# EAGLE design 1-voice(2_2) (EAGLE 9.3.2)

## Sheet 1 of 2
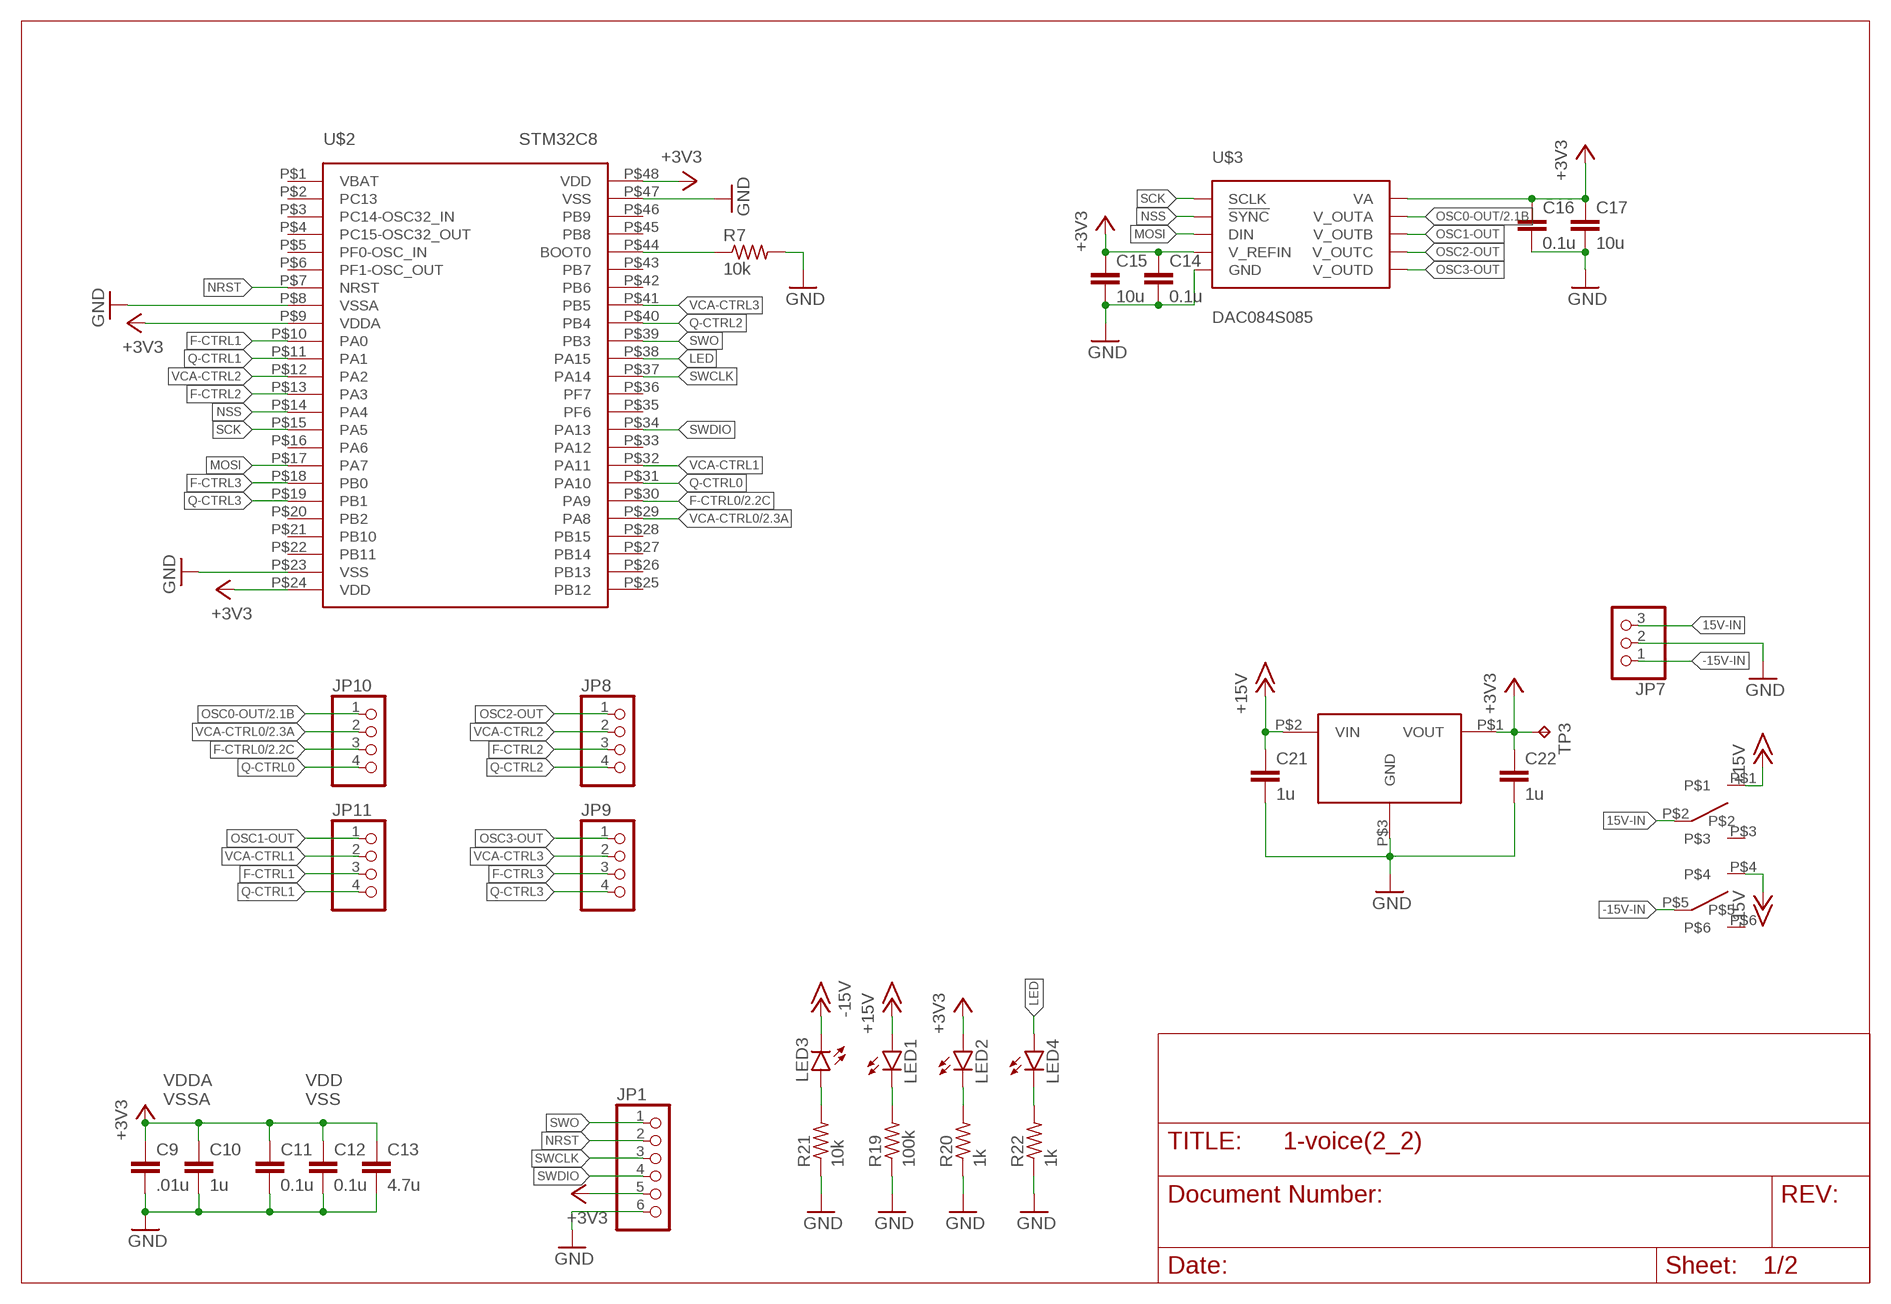
[diagram p0: schematic, sheet 1]

### Parts
C9  .01u  C-EUC0603  [C0603]
C10  1u  C-EUC0603  [C0603]
C11  0.1u  C-EUC0603  [C0603]
C12  0.1u  C-EUC0603  [C0603]
C13  4.7u  C-EUC0603  [C0603]
C14  0.1u  C-EUC0603  [C0603]
C15  10u  C-EUC0603  [C0603]
C16  0.1u  C-EUC0603  [C0603]
C17  10u  C-EUC0603  [C0603]
C21  1u  C-EUC0603  [C0603]
C22  1u  C-EUC0603  [C0603]
JP1  PINHD-1X6  [1X06]
JP7  PINHD-1X3  [1X03]
JP8  PINHD-1X4  [1X04]
JP9  PINHD-1X4  [1X04]
JP10  PINHD-1X4  [1X04]
JP11  PINHD-1X4  [1X04]
LED1  LEDSMT1206  [1206]
LED2  LEDSMT1206  [1206]
LED3  LEDSMT1206  [1206]
LED4  LEDSMT1206  [1206]
R7  10k  R-US_R0603  [R0603]
R19  100k  R-US_R0603  [R0603]
R20  1k  R-US_R0603  [R0603]
R21  10k  R-US_R0603  [R0603]
R22  1k  R-US_R0603  [R0603]
TP3  TPPAD1-13  [P1-13]
U$2  STM32C8  [LQFP48]
U$3  DAC084S085  [VSSOP10]
U$4  TLV760  [SOT23-3]
U$6  SWITCH-DPDT  [DPDT]

### Nets
15V-IN: JP7.3 U$6.P$2
+3V3: C9.1 C10.1 C11.1 C12.1 C13.1 C14.1 C15.1 C16.1 C17.1 C22.1 JP1.5 LED2.A TP3.TP U$2.P$9(VDDA) U$2.P$24(VDD) U$2.P$48(VDD) U$3.P$1(VA) U$3.P$7(V_REFIN) U$4.P$1(VOUT) ; also sheet 2
+15V: C21.1 LED1.A U$4.P$2(VIN) U$6.P$1 ; also sheet 2
-15V: LED3.C U$6.P$4 ; also sheet 2
-15V-IN: JP7.1 U$6.P$5
F-CTRL0: JP10.3 U$2.P$30(PA9) ; also sheet 2
F-CTRL1: JP11.3 U$2.P$10(PA0)
F-CTRL2: JP8.3 U$2.P$13(PA3)
F-CTRL3: JP9.3 U$2.P$18(PB0)
GND: C9.2 C10.2 C11.2 C12.2 C13.2 C14.2 C15.2 C16.2 C17.2 C21.2 C22.2 JP1.6 JP7.2 R7.2 R19.1 R20.1 R21.1 R22.1 U$2.P$8(VSSA) U$2.P$23(VSS) U$2.P$47(VSS) U$3.P$6(GND) U$4.P$3(GND) ; also sheet 2
LED: LED4.A U$2.P$38(PA15)
MOSI: U$2.P$17(PA7) U$3.P$8(DIN)
N$8: R7.1 U$2.P$44(BOOT0)
N$17: LED1.C R19.2
N$18: LED2.C R20.2
N$21: LED3.A R21.2
N$22: LED4.C R22.2
NRST: JP1.2 U$2.P$7(NRST)
NSS: U$2.P$14(PA4) U$3.P$9(!SYNC)
OSC0-OUT: JP10.1 U$3.P$2(V_OUTA) ; also sheet 2
OSC1-OUT: JP11.1 U$3.P$3(V_OUTB)
OSC2-OUT: JP8.1 U$3.P$4(V_OUTC)
OSC3-OUT: JP9.1 U$3.P$5(V_OUTD)
Q-CTRL0: JP10.4 U$2.P$31(PA10)
Q-CTRL1: JP11.4 U$2.P$11(PA1)
Q-CTRL2: JP8.4 U$2.P$40(PB4)
Q-CTRL3: JP9.4 U$2.P$19(PB1)
SCK: U$2.P$15(PA5) U$3.P$10(SCLK)
SWCLK: JP1.3 U$2.P$37(PA14)
SWDIO: JP1.4 U$2.P$34(PA13)
SWO: JP1.1 U$2.P$39(PB3)
VCA-CTRL0: JP10.2 U$2.P$29(PA8) ; also sheet 2
VCA-CTRL1: JP11.2 U$2.P$32(PA11)
VCA-CTRL2: JP8.2 U$2.P$12(PA2)
VCA-CTRL3: JP9.2 U$2.P$41(PB5)
Unconnected: U$2.P$1(VBAT) U$2.P$2(PC13) U$2.P$3(PC14-OSC32_IN) U$2.P$4(PC15-OSC32_OUT) U$2.P$5(PF0-OSC_IN) U$2.P$6(PF1-OSC_OUT) U$2.P$16(PA6) U$2.P$20(PB2) U$2.P$21(PB10) U$2.P$22(PB11) U$2.P$25(PB12) U$2.P$26(PB13) U$2.P$27(PB14) U$2.P$28(PB15) U$2.P$33(PA12) U$2.P$35(PF6) U$2.P$36(PF7) U$2.P$42(PB6) U$2.P$43(PB7) U$2.P$45(PB8) U$2.P$46(PB9) U$6.P$3 U$6.P$6

### Notes on the sheet
- VDDA
  VSSA
- VDD
  VSS

## Sheet 2 of 2
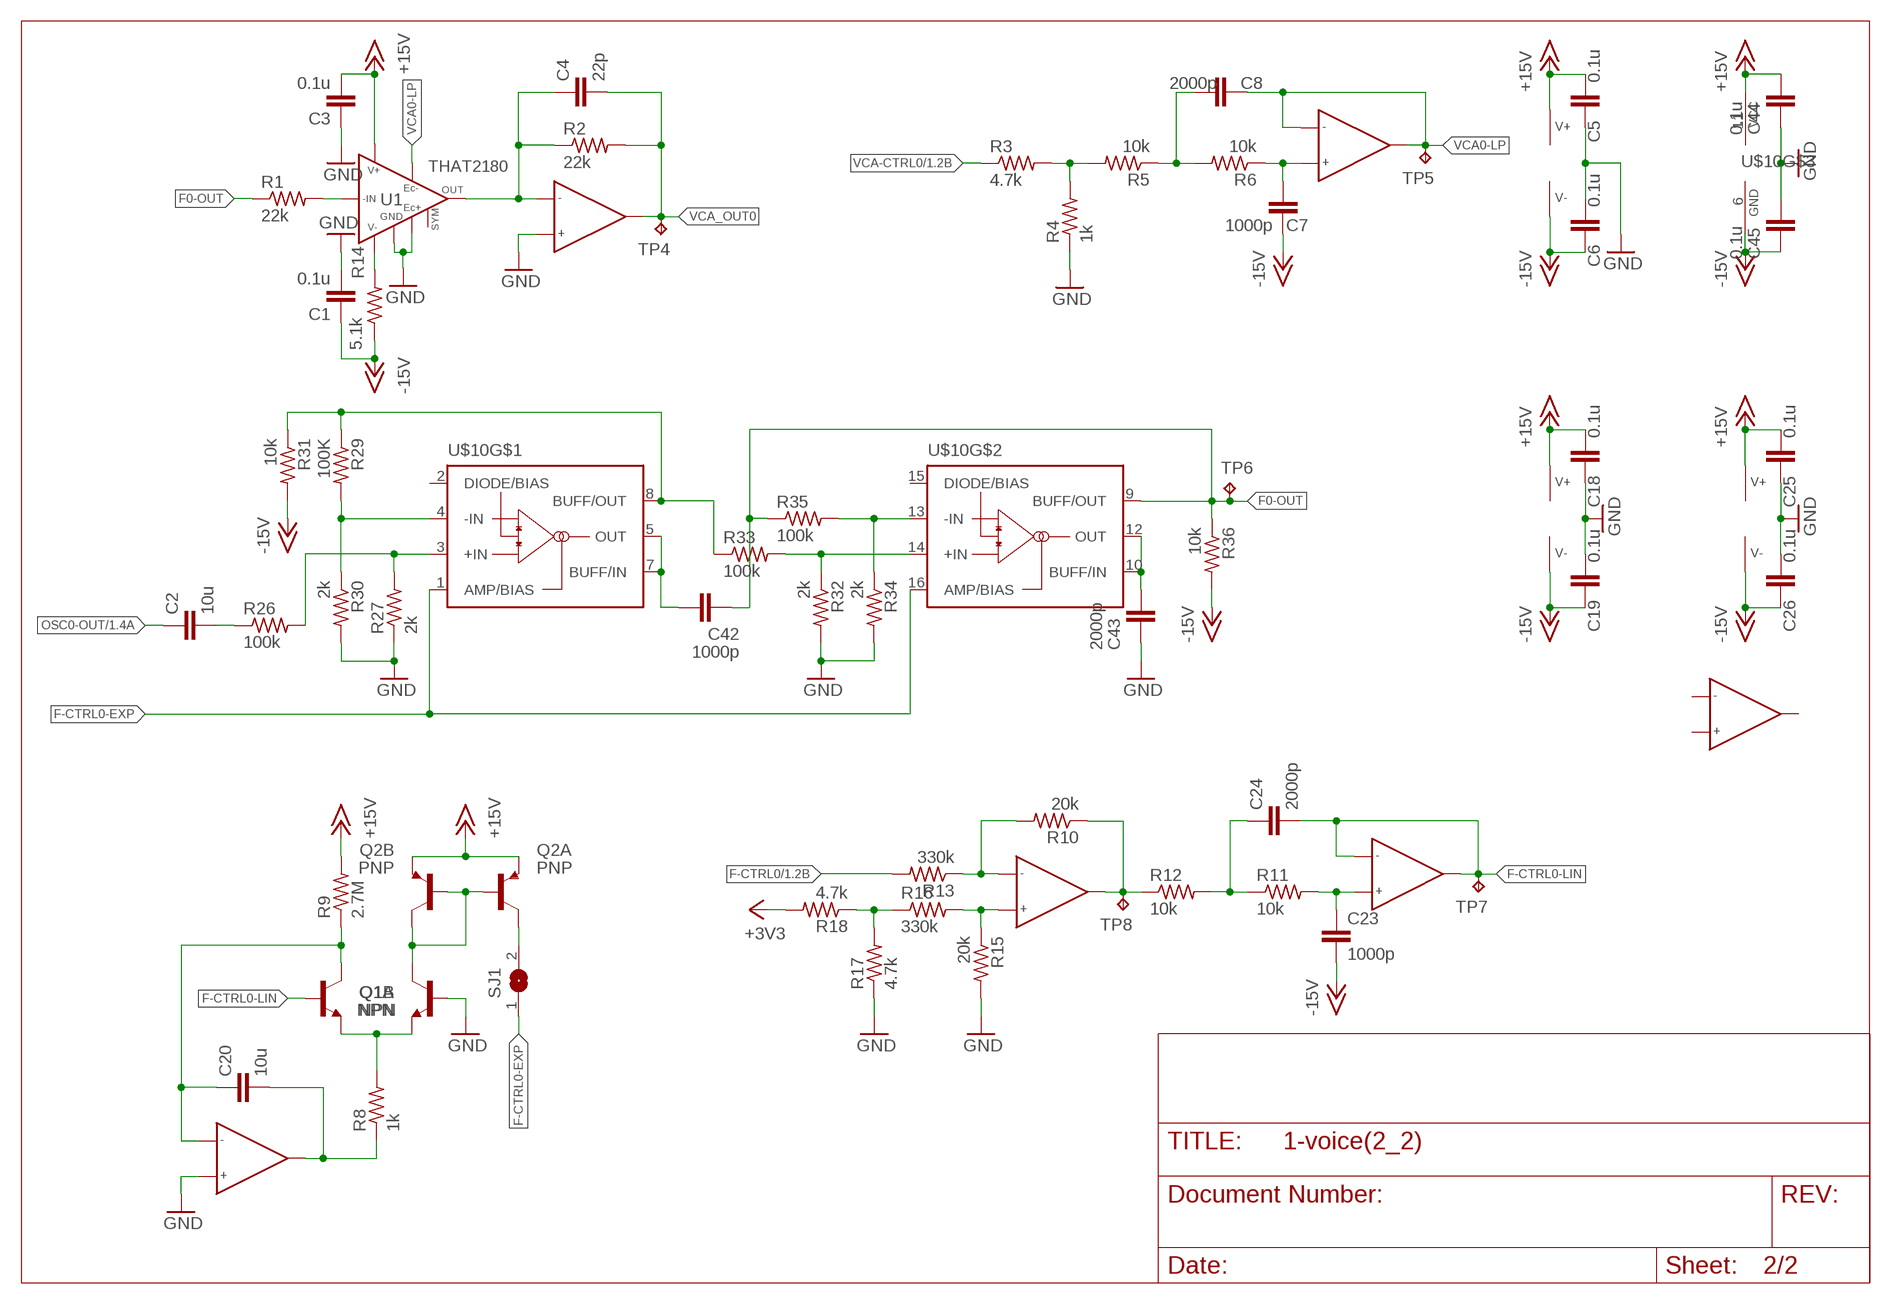
[diagram p1: schematic, sheet 2]

### Parts
C1  0.1u  C-EUC0603  [C0603]
C2  10u  C-EUC0603  [C0603]
C3  0.1u  C-EUC0603  [C0603]
C4  22p  C-EUC0603  [C0603]
C5  0.1u  C-EUC0603  [C0603]
C6  0.1u  C-EUC0603  [C0603]
C7  1000p  C-EUC0603  [C0603]
C8  2000p  C-EUC0603  [C0603]
C18  0.1u  C-EUC0603  [C0603]
C19  0.1u  C-EUC0603  [C0603]
C20  10u  C-EUC0603  [C0603]
C23  1000p  C-EUC0603  [C0603]
C24  2000p  C-EUC0603  [C0603]
C25  0.1u  C-EUC0603  [C0603]
C26  0.1u  C-EUC0603  [C0603]
C42  1000p  C-EUC0603  [C0603]
C43  2000p  C-EUC0603  [C0603]
C44  0.1u  C-EUC0603  [C0603]
C45  0.1u  C-EUC0603  [C0603]
Q1  NPN  TRANS-BJT_NPN-DUAL-BC847BS-JBLMASK  [SOT-363-JBLMASK]
Q2  PNP  TRANS-BJT_PNP-DUAL-BC857-JBLMASK  [SOT-363-JBLMASK]
R1  22k  R-US_R0603  [R0603]
R2  22k  R-US_R0603  [R0603]
R3  4.7k  R-US_R0603  [R0603]
R4  1k  R-US_R0603  [R0603]
R5  10k  R-US_R0603  [R0603]
R6  10k  R-US_R0603  [R0603]
R8  1k  R-US_R0603  [R0603]
R9  2.7M  R-US_R0603  [R0603]
R10  20k  R-US_R0603  [R0603]
R11  10k  R-US_R0603  [R0603]
R12  10k  R-US_R0603  [R0603]
R13  330k  R-US_R0603  [R0603]
R14  5.1k  R-US_R0603  [R0603]
R15  20k  R-US_R0603  [R0603]
R16  330k  R-US_R0603  [R0603]
R17  4.7k  R-US_R0603  [R0603]
R18  4.7k  R-US_R0603  [R0603]
R26  100k  R-US_R0603  [R0603]
R27  2k  R-US_R0603  [R0603]
R29  100K  R-US_R0603  [R0603]
R30  2k  R-US_R0603  [R0603]
R31  10k  R-US_R0603  [R0603]
R32  2k  R-US_R0603  [R0603]
R33  100k  R-US_R0603  [R0603]
R34  2k  R-US_R0603  [R0603]
R35  100k  R-US_R0603  [R0603]
R36  10k  R-US_R0603  [R0603]
SJ1  SJ  [SJ]
TP4  TPPAD1-13  [P1-13]
TP5  TPPAD1-13  [P1-13]
TP6  TPPAD1-13  [P1-13]
TP7  TPPAD1-13  [P1-13]
TP8  TPPAD1-13  [P1-13]
U1  THAT2180  [SIP8]
U$1  TL072  [SOIC8]
U$5  TL072  [SOIC8]
U$10  XX-13700DMP16  [DMP16]
U$11  TL072  [SOIC8]

### Nets
+3V3: R18.2 ; also sheet 1
+15V: C3.2 C5.2 C18.2 C25.2 C44.1 Q2.1(A:E) Q2.4(B:E) R9.2 U1.$P7(V+) U$1.P$8(V+) U$5.P$8(V+) U$10.11(VCC) U$11.P$8(V+) ; also sheet 1
-15V: C1.1 C6.1 C7.1 C19.1 C23.2 C26.1 C45.2 R14.1 R31.2 R36.2 U$1.P$4(V-) U$5.P$4(V-) U$10.6(GND) U$11.P$4(V-) ; also sheet 1
F0-OUT: C42.2 R1.1 R35.1 R36.1 TP6.TP U$10.9(BUFF/OUT)
F-CTRL0: R13.2 ; also sheet 1
F-CTRL0-EXP: SJ1.1 U$10.1(AMP/BIAS) U$10.16(AMP/BIAS)
F-CTRL0-LIN: C24.2 Q1.2(A:B) TP7.TP U$11.P$6(IN-) U$11.P$7(OUT)
FILT_IN: C2.2 R26.1
GND: C1.2 C3.1 C5.1 C6.2 C18.1 C19.2 C25.1 C26.2 C43.2 C44.2 C45.1 Q1.5(B:B) R4.1 R15.2 R17.1 R27.1 R30.2 R32.2 R34.2 U1.$P2(EC+) U1.$P6(GND) U$1.P$3(IN+) U$11.P$3(IN+) ; also sheet 1
N$1: R10.2 R13.1 U$5.P$6(IN-)
N$2: R1.2 U1.$P1(-IN)
N$3: C4.1 R2.1 U1.$P8(OUT) U$1.P$2(IN-)
N$4: R3.2 R4.2 R5.2
N$5: C8.2 R5.1 R6.2
N$6: C7.2 R6.1 U$1.P$5(IN+)
N$7: Q2.6(A:C) SJ1.2
N$9: Q1.1(A:E) Q1.4(B:E) R8.2
N$10: C20.2 R8.1 U$11.P$1(OUT)
N$11: C20.1 Q1.6(A:C) R9.1 U$11.P$2(IN-)
N$12: C23.1 R11.2 U$11.P$5(IN+)
N$13: Q1.3(B:C) Q2.2(A:B) Q2.3(B:C) Q2.5(B:B)
N$14: C24.1 R11.1 R12.2
N$15: R10.1 R12.1 TP8.TP U$5.P$7(OUT)
N$16: R14.2 U1.$P5(V-)
N$19: R16.1 R17.2 R18.1
N$20: R15.1 R16.2 U$5.P$5(IN+)
N$27: R26.2 R27.2 U$10.3(+IN)
N$31: R29.2 R30.1 U$10.4(-IN)
N$32: C42.1 U$10.5(OUT) U$10.7(BUFF/IN)
N$33: R29.1 R31.1 R33.1 U$10.8(BUFF/OUT)
N$34: C43.1 U$10.10(BUFF/IN) U$10.12(OUT)
N$35: R32.1 R33.2 U$10.14(+IN)
N$36: R34.1 R35.2 U$10.13(-IN)
OSC0-OUT: C2.1 ; also sheet 1
VCA0-LP: C8.1 TP5.TP U1.$P3(EC-) U$1.P$6(IN-) U$1.P$7(OUT)
VCA-CTRL0: R3.1 ; also sheet 1
VCA_OUT0: C4.2 R2.2 TP4.TP U$1.P$1(OUT)
Unconnected: U1.$P4(SYM) U$5.P$1(OUT) U$5.P$2(IN-) U$5.P$3(IN+) U$10.2(DIODE/BIAS) U$10.15(DIODE/BIAS)

## Library data of the parts
C1-C26 C42-C45 = rcl:C-EU: CAPACITOR, European symbol; SPICEPREFIX: C
JP1 = pinhead:PINHD-1X6: PIN HEADER
JP7 = pinhead:PINHD-1X3: PIN HEADER
JP8-JP11 = pinhead:PINHD-1X4: PIN HEADER
LED1-LED4 = led:LED: LED OSRAM: - CHIPLED LG R971, LG N971, LY N971, LG Q971, LY Q971, LO R971, LY R971 LH N974, LH R974 LS Q976, LO Q976, LY Q976 LO Q996 - Hyper CHIPLED LW Q18S LB Q993, LB Q99A, LB R99A - SideLED LS A670, LO A670, LY A670, LG A670, LP A670 LB A673, LV A673, LT A673, LW A673 LH A674 LY A675 LS A676, LA A676, LO A676, LY A676, LW A676 LS A679, LY A679, LG A679 - Hyper Micro SIDELED® LS Y876, LA Y876, LO Y876, LY Y876 LT Y87S - SmartLED LW L88C, LW L88S LB L89C, LB L89S, LG L890 LS L89K, LO L89K, LY L89K LS L896, LA L896, LO L896, LY L896 - TOPLED LS T670, LO T670, LY T670, LG T670, LP T670 LSG T670, LSP T670, LSY T670, LOP T670, LYG T670 LG T671, LOG T671, LSG T671 LB T673, LV T673, LT T673, LW T673 LH T674 LS T676, LA T676, LO T676, LY T676, LB T676, LH T676, LSB T676, LW T676 LB T67C, LV T67C, LT T67C, LS T67K, LO T67K, LY T67K, LW E67C LS E67B, LA E67B, LO E67B, LY E67B, LB E67C, LV E67C, LT E67C LW T67C LS T679, LY T679, LG T679 LS T770, LO T770, LY T770, LG T770, LP T770 LB T773, LV T773, LT T773, LW T773 LH T774 LS E675, LA E675, LY E675, LS T675 LS T776, LA T776, LO T776, LY T776, LB T776 LHGB T686 LT T68C, LB T68C - Hyper Mini TOPLED® LB M676 - Mini TOPLED Santana® LG M470 LS M47K, LO M47K, LY M47K Source: http://www.osram.convergy.de LUXEON: - LUMILED® LXK2-PW12-R00, LXK2-PW12-S00, LXK2-PW14-U00, LXK2-PW14-V00 LXK2-PM12-R00, LXK2-PM12-S00, LXK2-PM14-U00 LXK2-PE12-Q00, LXK2-PE12-R00, LXK2-PE12-S00, LXK2-PE14-T00, LXK2-PE14-U00 LXK2-PB12-K00, LXK2-PB12-L00, LXK2-PB12-M00, LXK2-PB14-N00, LXK2-PB14-P00, LXK2-PB14-Q00 LXK2-PR12-L00, LXK2-PR12-M00, LXK2-PR14-Q00, LXK2-PR14-R00 LXK2-PD12-Q00, LXK2-PD12-R00, LXK2-PD12-S00 LXK2-PH12-R00, LXK2-PH12-S00 LXK2-PL12-P00, LXK2-PL12-Q00, LXK2-PL12-R00 Source: www.luxeon.com KINGBRIGHT: KA-3528ASYC Source: www.kingbright.com
Q1 = LITTLEBITS:TRANS-BJT_NPN-DUAL
Q2 = LITTLEBITS:TRANS-BJT_PNP-DUAL
R1-R22 R26 R27 R29-R36 = rcl:R-US_: RESISTOR, American symbol; SPICEPREFIX: R
SJ1 = jumper:SJ: SMD solder JUMPER
TP3-TP8 = testpad:TP: Test pad
U1 = synth:THAT2180
U$1 U$5 U$11 = synth:TL072
U$2 = synth:STM32C8
U$3 = synth:DAC084S085
U$4 = synth:TLV760
U$6 = synth:SWITCH-DPDT
U$10 = LITTLEBITS:XX-13700

## Board
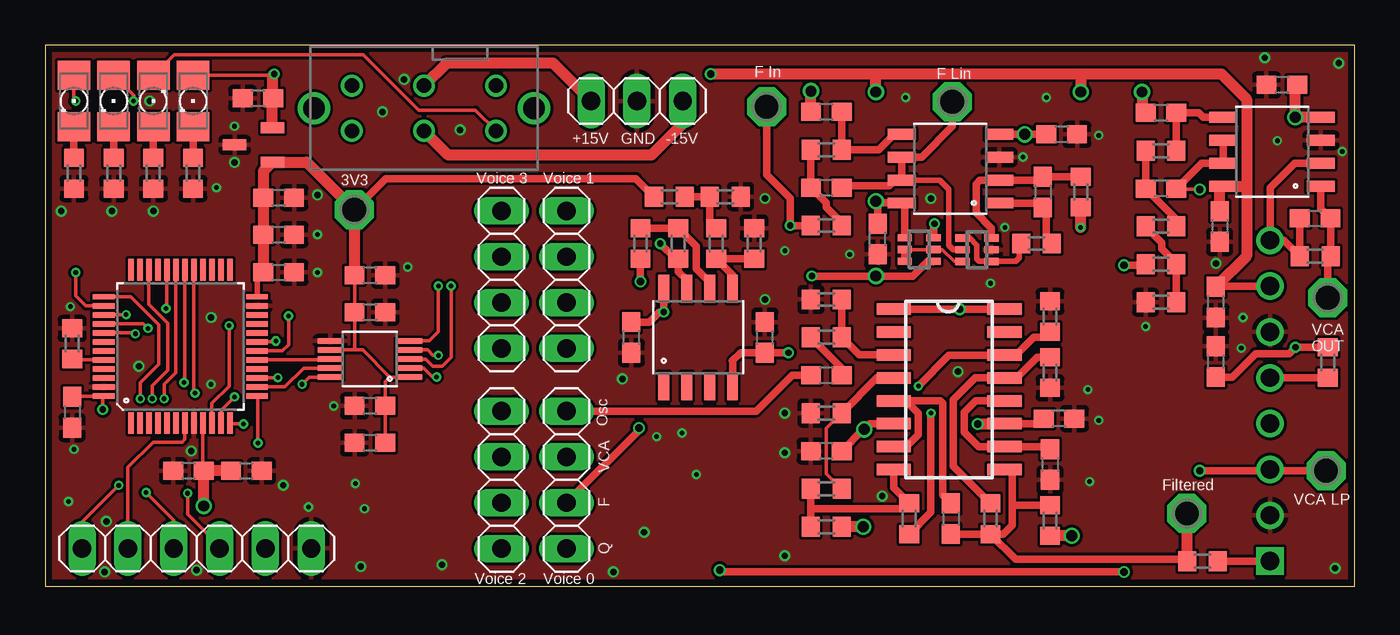
[diagram p2: board, top side]
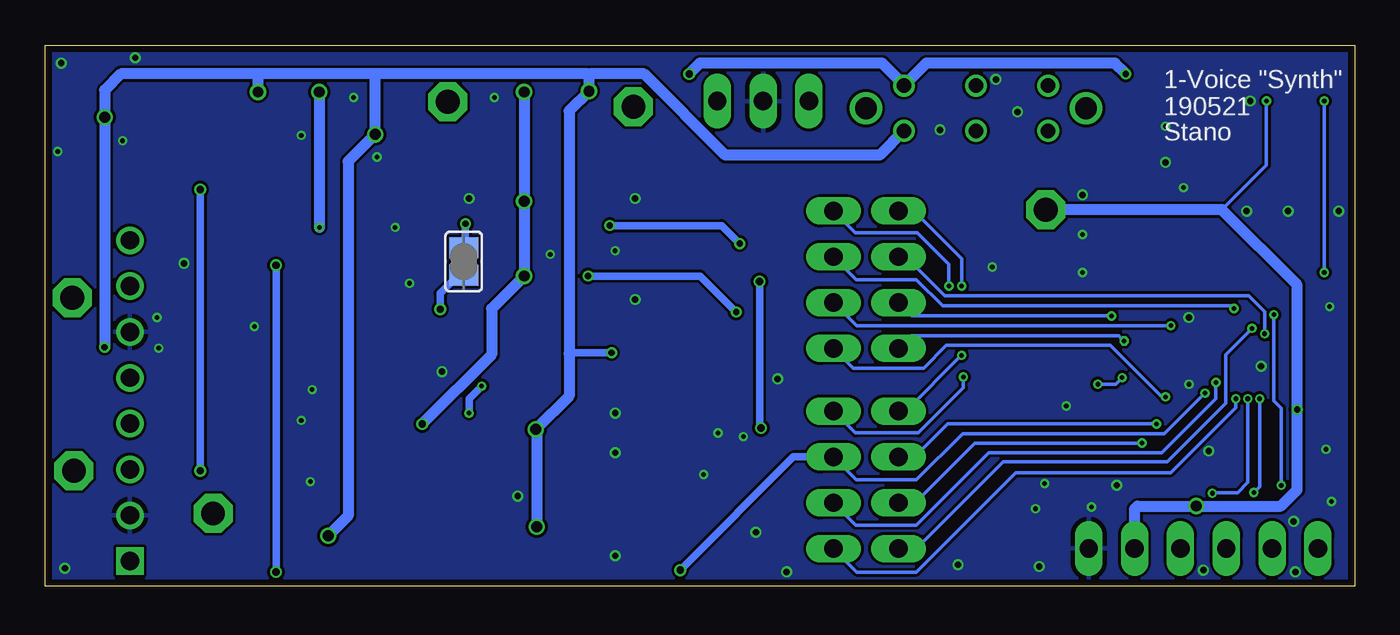
[diagram p3: board, bottom side, seen from below]

Size 72.6 x 30 mm. Coordinates in mm from the lower left corner, seen from the top.
Outline: 72.6,30 0,30 0,0 72.6,0 72.6,30
Copper layers (1*16): Top 0.035559375mm / dielectric 1.6mm / Bottom 0.035559375mm
Design rules "oshpark-2layer": minimum track width 6mil, minimum drill 10mil, track to track 6mil, track to pad 6mil, pad to pad 6mil, via to via 6mil, smd to smd 6mil, copper to edge 15mil, drill to drill 6mil, minimum pad ring 5mil, minimum via ring 5mil, stop-mask expansion 2.5mil, vias tented up to drill 0mil, thermal gap 10mil

### Footprints (pad centres in the part's own frame; a part is rotated, then mirrored left to right if it is on the bottom)
C0603 = smd 1.1 x 1: 1 -0.85,0; 2 0.85,0
1X06 = drill 1.016 long: 1 -6.35,0; 2 -3.81,0; 3 -1.27,0; 4 1.27,0; 5 3.81,0; 6 6.35,0
1X03 = drill 1.016 long: 1 -2.54,0; 2 0,0; 3 2.54,0
1X04 = drill 1.016 long: 1 -3.81,0; 2 -1.27,0; 3 1.27,0; 4 3.81,0
1206 = smd 1.6 x 1.803: A -1.422,0; C 1.422,0
SOT-363-JBLMASK = smd 0.4 x 0.8: 1 -0.65,-0.8; 2 0,-0.8; 3 0.65,-0.8; 4 0.65,0.8; 5 0,0.8; 6 -0.65,0.8
R0603 = smd 1 x 1.1: 1 -0.85,0; 2 0.85,0
SJ = smd 1.168 x 1.6: 1 -0.762,0; 2 0.762,0
P1-13 = drill 1.321 pad 2.159 octagon: TP 0,0
SIP8 = drill 1.016 square: $P1 0,0 | drill 1.016: $P2 2.54,0; $P3 5.08,0; $P4 7.62,0; $P5 10.16,0; $P6 12.7,0; $P7 15.24,0; $P8 17.78,0
SOIC8 = smd 0.6 x 1.55: P$1 -1.905,-2.7; P$2 -0.635,-2.7; P$3 0.635,-2.7; P$4 1.905,-2.7; P$5 1.905,2.7; P$6 0.635,2.7; P$7 -0.635,2.7; P$8 -1.905,2.7
LQFP48 = smd 0.3 x 1.2: P$1 -2.75,-4.25; P$2 -2.25,-4.25; P$3 -1.75,-4.25; P$4 -1.25,-4.25; P$5 -0.75,-4.25; P$6 -0.25,-4.25; P$7 0.25,-4.25; P$8 0.75,-4.25; P$9 1.25,-4.25; P$10 1.75,-4.25; P$11 2.25,-4.25; P$12 2.75,-4.25; P$25 2.75,4.25; P$26 2.25,4.25; P$27 1.75,4.25; P$28 1.25,4.25; P$29 0.75,4.25; P$30 0.25,4.25; P$31 -0.25,4.25; P$32 -0.75,4.25; P$33 -1.25,4.25; P$34 -1.75,4.25; P$35 -2.25,4.25; P$36 -2.75,4.25 | smd 1.2 x 0.3: P$13 4.25,-2.75; P$14 4.25,-2.25; P$15 4.25,-1.75; P$16 4.25,-1.25; P$17 4.25,-0.75; P$18 4.25,-0.25; P$19 4.25,0.25; P$20 4.25,0.75; P$21 4.25,1.25; P$22 4.25,1.75; P$23 4.25,2.25; P$24 4.25,2.75; P$37 -4.25,2.75; P$38 -4.25,2.25; P$39 -4.25,1.75; P$40 -4.25,1.25; P$41 -4.25,0.75; P$42 -4.25,0.25; P$43 -4.25,-0.25; P$44 -4.25,-0.75; P$45 -4.25,-1.25; P$46 -4.25,-1.75; P$47 -4.25,-2.25; P$48 -4.25,-2.75
VSSOP10 = smd 1.45 x 0.3: P$1 -2.2,1; P$2 -2.2,0.5; P$3 -2.2,0; P$4 -2.2,-0.5; P$5 -2.2,-1; P$6 2.2,-1; P$7 2.2,-0.5; P$8 2.2,0; P$9 2.2,0.5; P$10 2.2,1
SOT23-3 = smd 0.6 x 1.3: P$1 -0.95,-1.05; P$2 0.95,-1.05; P$3 0,1.05
DPDT = drill 0.8: P$1 -4,-1.25; P$2 0,-1.25; P$3 4,-1.25; P$4 -4,1.25; P$5 0,1.25; P$6 4,1.25 | drill 1.2: P$7 -6.1,0; P$8 6.1,0
DMP16 = smd 1.91 x 0.64: 1 -6.47,9.145; 2 -6.47,7.875; 3 -6.47,6.605; 4 -6.47,5.335; 5 -6.47,4.065; 6 -6.47,2.795; 7 -6.47,1.525; 8 -6.47,0.255; 9 -0.33,0.255; 10 -0.33,1.525; 11 -0.33,2.795; 12 -0.33,4.065; 13 -0.33,5.335; 14 -0.33,6.605; 15 -0.33,7.875; 16 -0.33,9.145

### Placement (x,y rotation side)
C1  64.9,12.45 90 top
C2  43.3,11.7 0 top
C3  64.9,15.75 90 top
C4  70.4,20.4 0 top
C5  46.15,19.25 90 top
C6  68.55,27.8 180 top
C7  61.85,26.25 0 top
C8  61.85,22.05 180 top
C9  11.15,6.4 0 top
C10  7.95,6.4 180 top
C11  12.95,17.4 0 top
C12  1.5,9.65 270 top
C13  12.95,19.5 0 top
C14  18,15.2 0 top
C15  18,17.25 0 top
C16  18,10 180 top
C17  18,7.95 180 top
C18  56.2,9.3 180 top
C19  43.3,7.5 180 top
C20  55.3,21.85 270 top
C21  11.8,27.05 180 top
C22  12.95,21.55 0 top
C23  43.3,26.3 180 top
C24  43.3,22.1 0 top
C25  32.5,13.8 90 top
C26  39.9,13.8 90 top
C42  50.2,3.75 270 top
C43  55.7,6.75 270 top
C44  65.1,19.95 270 top
C45  56.35,25.05 180 top
JP1  8.4,2.1 0 top
JP7  32.8,26.9 180 top
JP8  25.3,5.9 270 top
JP9  25.3,17 270 top
JP10  28.9,5.9 270 top
JP11  28.9,17 270 top
LED1  8.2,26.9 270 top
LED2  3.8,26.9 270 top
LED3  6,26.9 90 top
LED4  1.6,26.9 270 top
Q1  51.65,18.66 270 top
Q2  48.45,18.67 270 top
R1  64.15,1.4 0 top
R2  70.4,18.3 0 top
R3  61.85,17.85 0 top
R4  61.85,15.75 0 top
R5  61.85,19.95 180 top
R6  61.85,24.15 180 top
R7  1.5,13.45 90 top
R8  54.95,19 180 top
R9  57.4,21.85 270 top
R10  35.1,19 90 top
R11  43.3,24.2 0 top
R12  43.3,20 0 top
R13  33,19 270 top
R14  71.1,12.4 270 top
R15  39.3,19 90 top
R16  37.2,19 270 top
R17  37.7,21.6 180 top
R18  34.6,21.6 180 top
R19  8.2,22.9 90 top
R20  3.8,22.9 90 top
R21  6,22.9 90 top
R22  1.6,22.9 90 top
R26  43.3,13.8 0 top
R27  43.3,15.9 0 top
R29  43.3,5.4 0 top
R30  43.3,9.6 180 top
R31  43.3,3.3 0 top
R32  55.7,14.95 90 top
R33  47.9,3.75 270 top
R34  55.7,11.85 270 top
R35  52.4,3.75 90 top
R36  55.7,3.65 270 top
SJ1  49.4,18 90 bottom
TP3  17.14,20.88 0 top
TP4  71.09,16 0 top
TP5  71,6.4 0 top
TP6  63.29,4.04 0 top
TP7  50.29,26.86 0 top
TP8  39.99,26.58 0 top
U1  67.9,1.4 90 top
U$1  68.01,24.09 90 top
U$2  7.5,13.3 0 top
U$3  18,12.6 180 top
U$4  11.55,24.47 90 top
U$5  36.2,13.8 0 top
U$6  21,26.5 180 top
U$10  53.51,6.22 0 top
U$11  50.18,23.15 90 top

### Tracks (layer width: path | path; a pad name or v marks a point on that pad's centre or on a via)
15V-IN
  Top 0.61: JP7.3 28.16,29 22.25,29 U$6.P$2
+3V3  (via drill 0.25, 0.35, 0.6)
  Top 0.203: U$3.P$7 17.2,13.1 | 17.2,13.1 17.6,13.1 19.1,11.6 | 19.1,11.6 U$3.P$1 | C11.1 11.75,17.05 | 17.2,13.1 17.15,13.15 C14.1 C15.1 | C17.1 C16.1 18.85,11.35 19.1,11.6 | U$2.P$9 8.75,6.45 C10.1 | LED2.A 4.9,27.22 v4.9,26.9 | v3.2,9.8 3.2,10.5 U$2.P$48 1.55,10.55 C12.1
  Top 0.305: 11.75,17.05 U$2.P$24
  Top 0.406: R18.2 32.75,22.6 18.88,22.6 TP3.TP
  Top 0.61: v8.8,4.45 C10.1 C9.1 | C11.1 C13.1 C22.1 12.1,23.02 U$4.P$1 14.5,23.52 TP3.TP C15.1
  Bottom 0.203: v4.9,26.9 4.9,23.35 7.37,20.88
  Bottom 0.61: JP1.5 12.21,4.29 12.05,4.45 v8.8,4.45 4.1,4.45 3.2,5.35 v3.2,9.8 3.2,16.71 7.37,20.88 TP3.TP
+15V  (via drill 0.25, 0.35, 0.4, 0.6)
  Top 0.203: 64.94,16.64 C3.2 | 47.65,21.07 U$11.P$8 | Q2.4 49.23,18 | 55.07,9.02 C18.2 | LED1.A 12.62,28.32 v12.7,28.4
  Top 0.406: U1.$P7 64.94,16.64 | Q2.1 47.65,21.07 | 49.23,18 48.9,18 48.1,17.2 v46.05,17.2 v42.5,17.2 | U$10.11 55.07,9.02 | U$11.P$8 46.15,21.25 | v46.05,21.35 46.15,21.25 | C5.2 46.15,21.25 | C25.2 33.5,14.65 34.05,15.21 v34.3,15.21 U$5.P$8
  Top 0.61: v36.9,28.4 46.05,28.4 | v51.7,9 51.72,9.02 U$10.11 | 57.4,28.4 v57.4,27.4 | v57.4,19.9 R9.2 | 66.6,22.2 66.6,18.3 C3.2 | C44.1 65.1,21.98 U$1.P$8 66.58,22.18 66.6,22.2 | v46.05,27.4 46.05,28.4 | 57.4,28.4 65.2,28.4 66.6,27 66.6,22.2 | 46.05,28.4 57.4,28.4 | v12.7,28.4 12.6,28.3 12.6,27.1 C21.1 12.6,27 U$4.P$2
  Bottom 0.406: v34.3,15.21 36.29,17.2 v42.5,17.2
  Bottom 0.61: v57.4,27.4 v57.4,19.9 | v46.05,27.4 v46.05,21.35 v46.05,17.2 47.85,15.4 47.85,12.85 v51.7,9 | v36.9,28.4 36.3,29 26.2,29 25,27.8 U$6.P$1 23.75,29 13.3,29 v12.7,28.4
-15V  (via drill 0.35, 0.6)
  Top 0.203: v54.3,25.05 | U$6.P$4 23.85,26.4 20.7,26.4 17.62,29.48 7.15,29.48 LED3.C
  Top 0.406: U$11.P$4 v54.3,25.05 | v54.3,25.05 C45.2 | U$5.P$4 38.11,12.49 38.1,12.5 38.55,12.95 C26.1 v41.2,12.95 | U$10.6 45.72,9.02 v45.4,8.7 45.35,8.7 C19.1 | R14.1 v69.3,13.25 68.95,12.9 67.1,12.9 65.8,11.6 C1.1
  Top 0.61: C23.2 v42.45,27.45 | v56.9,2.8 R36.2 | v60.8,27.4 60.8,26.45 C7.1 | U$1.P$4 v69.3,26 69.3,27.7 C6.1 | v45.35,3.3 R31.2
  Bottom 0.406: v41.2,12.95 43.5,12.95 43.55,12.9
  Bottom 0.61: 42.45,28.35 42.4,28.4 39.4,28.4 34.9,23.9 26.35,23.9 U$6.P$4 | 54.3,28.4 42.5,28.4 42.45,28.35 | 54.3,28.4 60.8,28.4 | 60.8,28.4 68.4,28.4 69.3,27.5 v69.3,26 v69.3,13.25 | 42.45,28.35 v42.45,27.45 43.55,26.35 43.55,12.9 43.55,10.55 v45.4,8.7 45.35,8.7 v45.35,3.3 | 54.3,28.4 v54.3,25.05 55.8,23.55 55.8,3.9 v56.9,2.8 | 60.8,28.4 v60.8,27.4
-15V-IN
  Top 0.61: JP7.1 35.34,25.64 33.6,23.9 22.35,23.9 U$6.P$5
F0-OUT
  Top 0.203: 53.6,6.2 53.7,6.3 53.52,6.47 U$10.9
  Top 0.406: R35.1 53.1,2.9 53.6,3.4 53.6,4.5 | 53.6,4.5 53.6,6.2 | C42.2 R35.1 | R36.1 53.6,4.5 | R1.1 63.2,1.5 53.8,1.5 R35.1
  Top 0.61: TP6.TP R1.1
F-CTRL0  (via drill 0.25, 0.4)
  Top 0.203: U$2.P$30 7.75,11.35 v7.7,11.3
  Top 0.406: R13.2 v33,16.9 | JP10.3 32.92,8.65 v32.92,8.78
  Bottom 0.203: v7.7,11.3 7.7,10.4 10.7,7.4 20.3,7.4 24.3,3.4 27.67,3.4 JP10.3
  Bottom 0.406: v32.92,8.78 33,8.86 v33,16.9
F-CTRL0-EXP  (via drill 0.4)
  Top 0.406: U$10.1 v50.7,15.37 U$10.16
  Bottom 0.406: SJ1.1 49.7,17.24 50.7,16.24 v50.7,15.37
F-CTRL0-LIN
  Top 0.203: 47.12,22.52 U$11.P$7
  Top 0.305: U$11.P$7 49.59,22.52 50.1,22 50.1,18.9 50.34,18.66 Q1.2
  Top 0.406: U$11.P$7 U$11.P$6 48.59,23.79 50.29,25.49 TP7.TP | C24.2 44.25,22.2 46.8,22.2 47.12,22.52
F-CTRL1  (via drill 0.25)
  Top 0.203: U$2.P$10 9.25,10.15 10.2,11.1 v10.2,14.45
  Bottom 0.203: JP11.3 27.62,14.45 v10.2,14.45
F-CTRL2  (via drill 0.25)
  Top 0.203: U$2.P$13 11.8,10.5 v11.8,7.94
  Bottom 0.203: v11.8,7.94 21.06,7.94 24.4,4.6 25.27,4.6 JP8.3
F-CTRL3  (via drill 0.25)
  Top 0.203: U$2.P$18 13.15,13.05 13.5,13.4 v13.5,14.98 v13.49,14.99
  Bottom 0.203: v13.49,14.99 v13.49,15 24.57,15 JP9.3
FILT_IN
  Top 0.406: C2.2 44.15,12.1 R26.1
GND  (via drill 0.25, 0.35)
  other vias: 53.2,19.9 35.3,8.5 33.9,8.3 1.3,4.7 14.6,4.4 17.7,4.3 17.2,5.7 9.2,11.2 15.1,19.5 15.1,17.4 20.1,17.7 9.5,22.1 10.5,25.5 47.7,27.1 54.2,23.8 68.3,24.7 71.9,24.1 58.4,25 61,14.4 66.4,14.9 66.3,13.2 57.9,5.8 58.4,9.2 57.8,10.9 36.1,6.2 41,18.6 44.6,18.4 52.4,16.8 16,10 1.4,15.5 1.6,7.6 55.5,27.1 0.9,20.8 3.7,20.8 6,20.8 10.5,23.5 5.2,12.2 9.2,14.9 8.1,7.5 13.2,5.6 17.5,1.1 22,1.2 15.1,21.7 18.7,26.3 39.9,21.5 39.9,15.9 33.2,3 31.5,0.8 41,1.7 41,7.4 41,9.6 32,11.5 67.6,29.3 71.7,29 64.9,17.9 71.5,1 3.4,3.6 3.3,0.8 8.4,0.9 19.9,28.1 23,25.3 46.4,5 50.6,11.9 49.1,21.5 5.8,26.9
  pour Top: 0,0 0,30 72.6,30 72.6,0
  pour Bottom: 0,0 0,30 72.6,30 72.6,0
LED  (via drill 0.25)
  Top 0.203: v1.7,26.9 1.6,27 LED4.A | v1.7,17.4 1.7,16.1 2.25,15.55 U$2.P$38
  Bottom 0.203: v1.7,26.9 v1.7,17.4
MOSI
  Top 0.203: U$3.P$8 15.75,12.55 U$2.P$17
N$1
  Top 0.406: U$5.P$6 36.84,16.86 36.1,17.6 36.1,18.85 R10.2 R13.1
N$2
  Top 0.406: U1.$P1 R1.2
N$3
  Top 0.406: C4.1 R2.1 68.67,19.18 U1.$P8 67.9,22.1 69.25,23.45 U$1.P$2
N$4
  Top 0.203: 62.7,17.9 R3.2
  Top 0.406: R5.2 61.9,19.05 61.9,18.7 62.7,17.9 | R3.2 R4.2
N$5
  Top 0.203: 62.7,20.35 R5.1
  Top 0.406: R6.2 C8.2 62.7,20.35
N$6
  Top 0.406: R6.1 C7.2 63.95,26.25 64.2,26 U$1.P$5
N$7  (via drill 0.35)
  Top 0.406: Q2.6 49.25,20.05 v49.3,20.1
  Bottom 0.406: v49.3,20.1 49.3,18.86 SJ1.2
N$8
  Top 0.203: U$2.P$44 1.55,12.55 R7.1
N$9
  Top 0.203: 54,18.9 R8.2
  Top 0.305: Q1.1 51.24,19.31 51.65,18.9 51.65,18.15 51.79,18.01 Q1.4 53.81,18.01 54,18.2 54,18.9
N$10
  Top 0.203: 55.05,21.25 C20.2 55.5,20.8
  Top 0.406: U$11.P$1 55.05,21.25 | 55.5,20.8 55.5,19.3 R8.1
N$11
  Top 0.203: 55.12,22.52 C20.1
  Top 0.406: 55.12,22.52 U$11.P$2 51.82,22.52 51.6,22.3 51.6,20.7 52.45,19.85 Q1.6 | C20.1 R9.1
N$12
  Top 0.203: 47.05,25.05 U$11.P$5
  Top 0.406: C23.1 R11.2 46.2,24.2 47.05,25.05
N$13
  Top 0.203: Q2.2 Q2.5 49.73,18.67 50.39,18.01 Q1.3
  Top 0.406: Q2.2 Q2.3
N$14
  Top 0.203: 44.15,20.15 R12.2
  Top 0.406: R11.1 C24.1 43.3,21.25 43.3,21 44.15,20.15
N$15  (via drill 0.35)
  Top 0.406: TP8.TP 39.99,25.3 39.99,25.07 39.99,22.81 41.3,21.5 v41.3,20 R12.1 | U$5.P$7 35.57,16.98 35.1,17.45 R10.1 34.95,18.15 v34.1,19
  Bottom 0.406: v41.3,20 35.1,20 v34.1,19
N$16
  Top 0.406: U1.$P5 R14.2
N$17
  Top 0.406: LED1.C R19.2
N$18
  Top 0.406: LED2.C R20.2
N$19
  Top 0.406: R16.1 36.85,20.2 R17.2 R18.1
N$20
  Top 0.406: U$5.P$5 38.11,17.25 R16.2 R15.1
N$21
  Top 0.406: LED3.A R21.2
N$22
  Top 0.406: LED4.C R22.2
N$27
  Top 0.406: R27.2 R26.2 45.12,12.82 U$10.3
N$31
  Top 0.203: R30.1 43.3,8.75 43.3,6.25 R29.2
  Top 0.406: R30.1 46.11,11.55 U$10.4
N$32
  Top 0.203: U$10.5 47.72,10.29 | 49.75,5.05 C42.1 | 47.75,7.75 U$10.7
  Top 0.406: 49.75,5.05 49.75,10.15 49.62,10.29 47.72,10.29 48.4,9.6 48.4,8.4 47.75,7.75
N$33
  Top 0.203: 47.04,6.4 U$10.8
  Top 0.406: 47.04,6.4 47.04,5.46 R33.1 47.6,4.3 42.45,4.3 | R29.1 42.45,4.3 | 42.45,4.3 R31.1
N$34
  Top 0.203: 55.55,7.75 C43.1
  Top 0.406: U$10.12 51.59,10.29 50.95,9.65 50.95,8.55 51.76,7.75 U$10.10 55.55,7.75
N$35  (via drill 0.25)
  Top 0.203: 53.16,12.8 U$10.14 53.83,12.82 | 55.4,13.8 R32.1
  Top 0.406: v48.4,11.1 50.1,12.8 53.16,12.8 | R33.2 49.1,4.1 v49.1,9.6 | 53.83,12.82 54.8,13.8 55.4,13.8
  Bottom 0.406: v49.1,9.6 49.1,10.4 v48.4,11.1
N$36
  Top 0.203: U$10.13 53.86,11.55
  Top 0.406: R35.2 50.35,6.65 50.35,10.35 51.55,11.55 U$10.13 | R34.1 55,12.7 53.86,11.55
NRST
  Top 0.203: U$2.P$7 7.75,8.15 7.6,8 6,8 4.59,6.59 JP1.2
NSS
  Top 0.203: U$2.P$14 13.28,11.05 14.33,12.1 U$3.P$9
OSC0-OUT  (via drill 0.25)
  Top 0.203: U$3.P$2 21,12.1 21.5,11.6 v21.7,11.6
  Top 0.406: C2.1 41.4,11.7 39.41,9.71 JP10.1
  Bottom 0.203: JP10.1 27.69,8.5 24.2,8.5 21.7,11 v21.7,11.6
OSC1-OUT  (via drill 0.25)
  Top 0.203: U$3.P$3 21.1,12.6 21.5,12.2 22,12.2 22.5,12.7 v22.5,16.65
  Bottom 0.203: v22.5,16.65 22.5,17.85 24.25,19.6 27.69,19.6 JP11.1
OSC2-OUT  (via drill 0.25)
  Top 0.203: U$3.P$4 21.2,13.1 21.5,12.8 v21.8,12.8
  Bottom 0.203: v21.8,12.8 v21.81,12.8 24.9,9.71 JP8.1
OSC3-OUT  (via drill 0.25)
  Top 0.203: U$3.P$5 21.3,13.6 21.8,14.1 v21.8,16.65
  Bottom 0.203: v21.8,16.65 21.8,18.15 24.46,20.81 JP9.1
Q-CTRL0  (via drill 0.25)
  Top 0.203: U$2.P$31 7.25,11.85 6.6,11.2 v6.6,10.4
  Bottom 0.203: JP10.4 27.6,0.79 24.31,0.79 18.8,6.3 10.2,6.3 6.6,9.9 v6.6,10.4
Q-CTRL1  (via drill 0.25)
  Top 0.203: U$2.P$11 9.75,9.75 v10.5,10.5
  Bottom 0.203: v10.5,10.5 10.7,10.5 13.55,13.35 22.65,13.35 23.9,12.1 27.81,12.1 JP11.4
Q-CTRL2  (via drill 0.25)
  Top 0.203: U$2.P$40 5.45,14.55 v5.7,14.3
  Bottom 0.203: JP8.4 24.31,2.09 19.5,6.9 10.4,6.9 7.15,10.15 7.15,12.85 v5.7,14.3
Q-CTRL3  (via drill 0.25)
  Top 0.203: U$2.P$19 12.74,13.55 v12.79,13.6
  Bottom 0.203: v12.79,13.6 13.09,13.9 24.59,13.9 JP9.4
SCK  (via drill 0.25)
  Top 0.203: U$2.P$15 12.9,11.55 v12.9,11.57 | v14.25,11.2 14.65,11.6 U$3.P$10
  Bottom 0.203: v14.25,11.2 13.27,11.2 v12.9,11.57
SWCLK  (via drill 0.25)
  Top 0.203: U$2.P$37 4.75,16.05 6.3,14.5 6.3,12.3 5.28,11.28 v5.28,10.4 | v5.6,5.2 7.13,3.67 JP1.3
  Bottom 0.203: v5.28,10.4 5.28,5.52 v5.6,5.2
SWDIO  (via drill 0.25)
  Top 0.203: v5.94,10.4 5.94,11.12 6.8,11.98 6.8,14.58 5.75,15.63 U$2.P$34 | v7.9,5.16 7.9,4 9.67,2.23 JP1.4
  Bottom 0.203: v7.9,5.16 7.86,5.2 6.5,5.2 5.94,5.76 v5.94,10.4
SWO  (via drill 0.25)
  Top 0.203: U$2.P$39 v4.49,15.06 | v4.08,5.6 2.05,3.57 JP1.1
  Bottom 0.203: v4.49,15.06 4.49,10.31 4.5,10.3 4.08,9.88 v4.08,5.6
VCA0-LP  (via drill 0.4)
  Top 0.203: C8.1 62.75,22 v64,22 | U1.$P3 67.98,6.4
  Top 0.406: U$1.P$6 U$1.P$7 64.1,23.45 C8.1 | v64,6.4 67.98,6.4 TP5.TP
  Bottom 0.406: v64,22 v64,6.4
VCA-CTRL0  (via drill 0.25, 0.4)
  Top 0.203: U$2.P$29 8.25,10.77 v8.31,10.71 | 60.95,17.8 R3.1
  Top 0.406: v37.4,0.9 37.5,0.8 v59.8,0.8 | v59.8,17.8 60.95,17.8
  Bottom 0.203: JP10.2 27.63,5.9 24.3,5.9 21.75,8.45 10.57,8.45 v8.31,10.71
  Bottom 0.406: v59.8,17.8 v59.8,0.8 | JP10.2 31.13,7.17 v37.4,0.9
VCA-CTRL1  (via drill 0.25)
  Top 0.203: U$2.P$32 6.75,15.45 v6.7,15.4
  Bottom 0.203: v6.7,15.4 6.85,15.55 22.85,15.55 24.3,17 27.63,17 JP11.2
VCA-CTRL2  (via drill 0.25)
  Top 0.203: v11,9 10.3,9 U$2.P$12
  Bottom 0.203: v11,9 22.57,9 24.4,7.17 JP8.2
VCA-CTRL3  (via drill 0.25)
  Top 0.203: U$2.P$41 4.95,14.05 v5,14
  Bottom 0.203: v5,14 5,15.23 5.89,16.12 22.75,16.12 24.9,18.27 JP9.2
VCA_OUT0
  Top 0.203: 71.09,18.14 R2.2
  Top 0.406: R2.2 C4.2 70.71,20.94 U$1.P$1 | TP4.TP 71.09,18.14

### Text on the board
tPlace: F In | F Lin | +15V | GND | -15V | 3V3 | Voice 3 | Voice 1 | VCA / OUT | Osc | VCA | Filtered | F | VCA LP | Q | Voice 2 | Voice 0
bPlace: 1-Voice "Synth" | 190521 | Stano